# EAGLE design FINALMOTHERBOARD!!!!!!_morefinal (EAGLE 7.6.0)

## Sheet 1 of 2
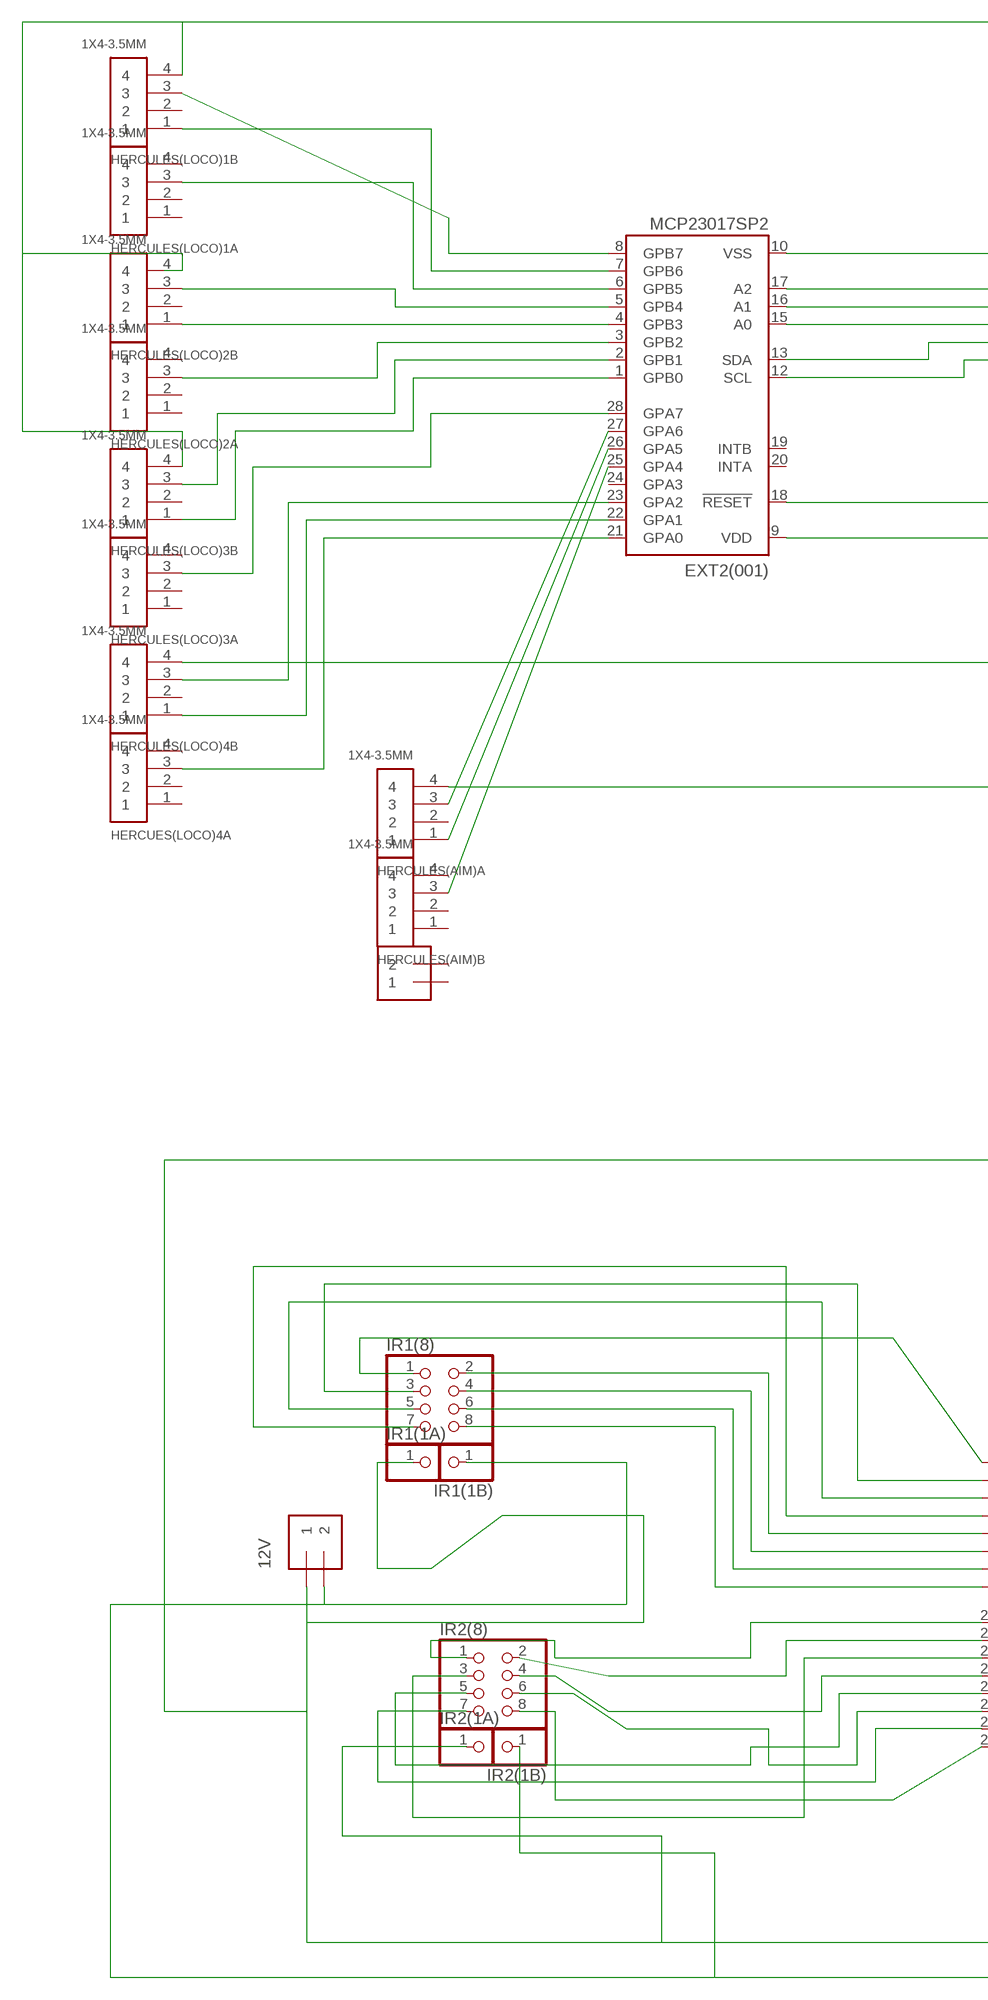
[diagram p0: schematic, sheet 1, part 1 of 2]
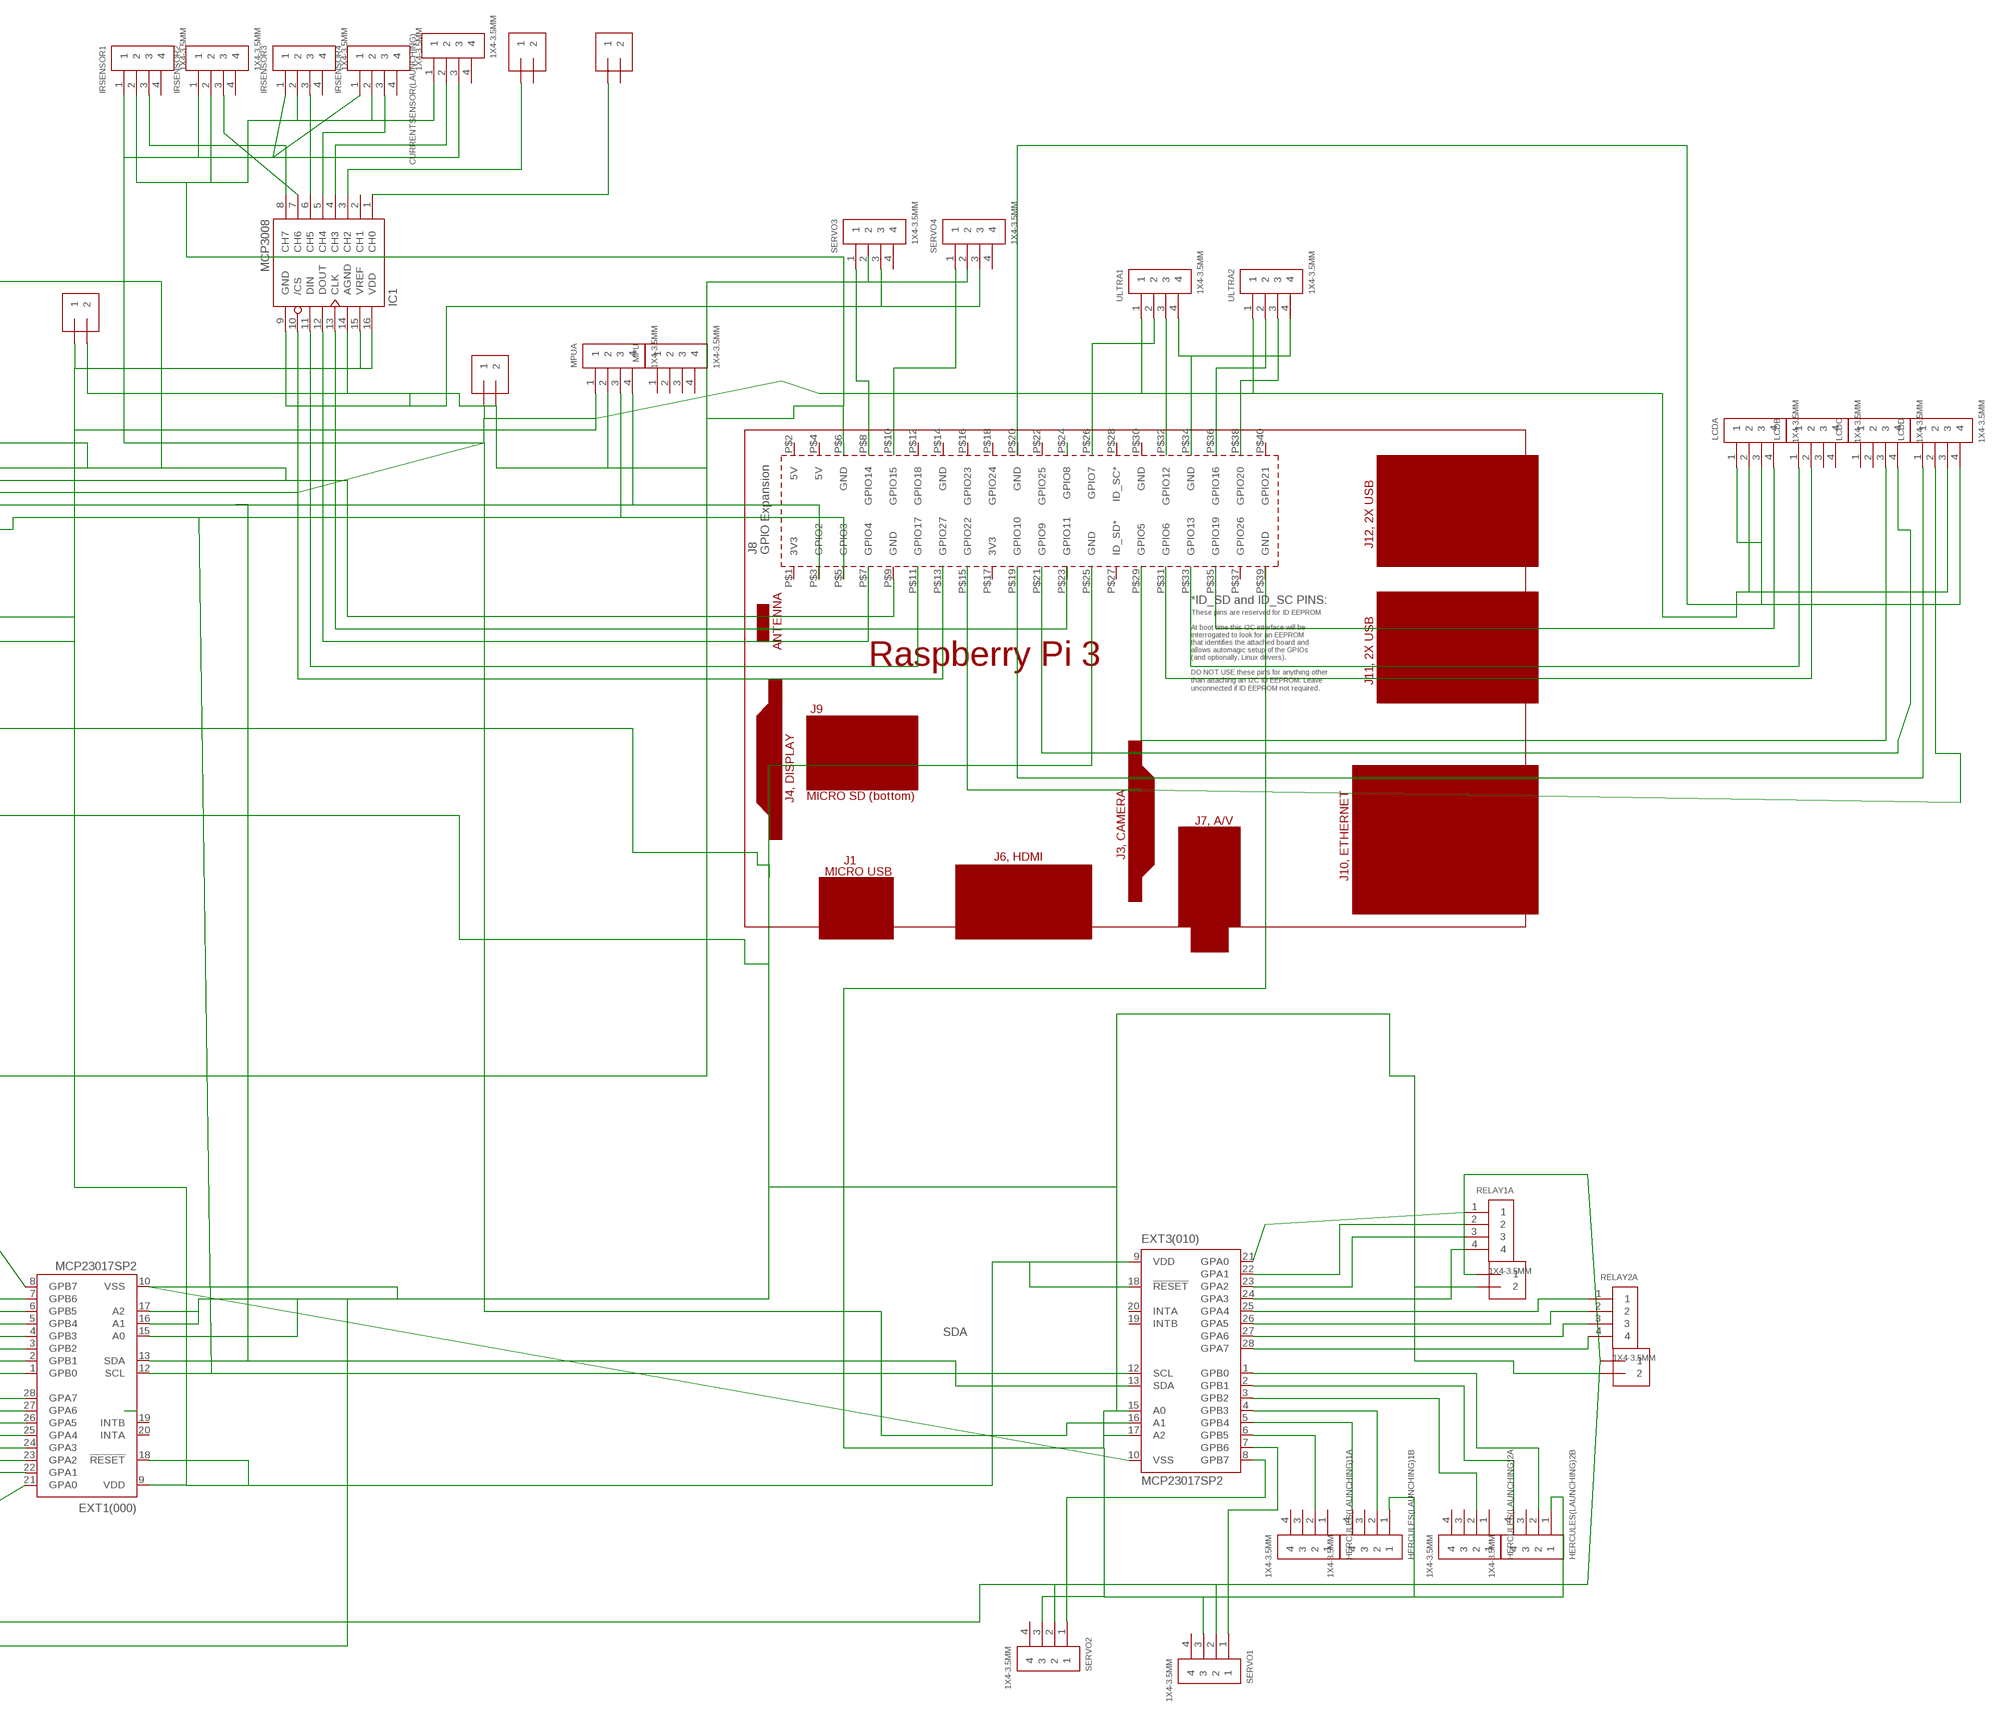
[diagram p1: schematic, sheet 1, part 2 of 2]

### Parts
3.3V  1X2-3.5MM  [1X2-3.5MM]
5V  1X2-3.5MM  [1X2-3.5MM]
12V  1X2-3.5MM  [1X2-3.5MM]
CURRENTSENSOR(LAUNCHING)  1X4-3.5MM  [1X04-3.5MM]
EXT1(000)  MCP23017SP2  [DIL28-3-ROUND]
EXT2(001)  MCP23017SP2  [DIL28-3-ROUND]
EXT3(010)  MCP23017SP2  [DIL28-3-ROUND]
HERCUES(LOCO)4A  1X4-3.5MM  [1X04-3.5MM]
HERCULES(AIM)A  1X4-3.5MM  [1X04-3.5MM]
HERCULES(AIM)B  1X4-3.5MM  [1X04-3.5MM]
HERCULES(AIM)C  1X2-3.5MM  [1X2-3.5MM]
HERCULES(LAUNCHING)1A  1X4-3.5MM  [1X04-3.5MM]
HERCULES(LAUNCHING)1B  1X4-3.5MM  [1X04-3.5MM]
HERCULES(LAUNCHING)2A  1X4-3.5MM  [1X04-3.5MM]
HERCULES(LAUNCHING)2B  1X4-3.5MM  [1X04-3.5MM]
HERCULES(LOCO)1A  1X4-3.5MM  [1X04-3.5MM]
HERCULES(LOCO)1B  1X4-3.5MM  [1X04-3.5MM]
HERCULES(LOCO)2A  1X4-3.5MM  [1X04-3.5MM]
HERCULES(LOCO)2B  1X4-3.5MM  [1X04-3.5MM]
HERCULES(LOCO)3A  1X4-3.5MM  [1X04-3.5MM]
HERCULES(LOCO)3B  1X4-3.5MM  [1X04-3.5MM]
HERCULES(LOCO)4B  1X4-3.5MM  [1X04-3.5MM]
IC1  MCP3008  [DIL16]
IR1(1A)  PINHD-1X1  [1X01]
IR1(1B)  PINHD-1X1  [1X01]
IR1(8)  PINHD-2X4  [2X04]
IR2(1A)  PINHD-1X1  [1X01]
IR2(1B)  PINHD-1X1  [1X01]
IR2(8)  PINHD-2X4  [2X04]
IR(LOCO)1ANALOG  1X2-3.5MM  [1X2-3.5MM]
IR(LOCO)2ANALOG  1X2-3.5MM  [1X2-3.5MM]
IRSENSOR1  1X4-3.5MM  [1X04-3.5MM]
IRSENSOR2  1X4-3.5MM  [1X04-3.5MM]
IRSENSOR3  1X4-3.5MM  [1X04-3.5MM]
IRSENSOR4  1X4-3.5MM  [1X04-3.5MM]
LCDA  1X4-3.5MM  [1X04-3.5MM]
LCDB  1X4-3.5MM  [1X04-3.5MM]
LCDC  1X4-3.5MM  [1X04-3.5MM]
LCDD  1X4-3.5MM  [1X04-3.5MM]
MPU  1X4-3.5MM  [1X04-3.5MM]
MPUA  1X4-3.5MM  [1X04-3.5MM]
PCB1  RPI3  [RPI3]
RELAY1A  1X4-3.5MM  [1X04-3.5MM]
RELAY1B  1X2-3.5MM  [1X2-3.5MM]
RELAY2A  1X4-3.5MM  [1X04-3.5MM]
RELAY2B  1X2-3.5MM  [1X2-3.5MM]
SERVO1  1X4-3.5MM  [1X04-3.5MM]
SERVO2  1X4-3.5MM  [1X04-3.5MM]
SERVO3  1X4-3.5MM  [1X04-3.5MM]
SERVO4  1X4-3.5MM  [1X04-3.5MM]
ULTRA1  1X4-3.5MM  [1X04-3.5MM]
ULTRA2  1X4-3.5MM  [1X04-3.5MM]

### Nets
3.3V: 3.3V.1 EXT1(000).9(VDD) EXT1(000).18(!RESET) EXT2(001).9(VDD) EXT2(001).18(!RESET) EXT3(010).9(VDD) EXT3(010).18(!RESET) IC1.15(VREF) IC1.16(VDD) MPUA.1
5V: 5V.1 CURRENTSENSOR(LAUNCHING).3 EXT2(001).15(A0) EXT3(010).16(A1) IRSENSOR1.1 IRSENSOR2.1 IRSENSOR3.1 IRSENSOR4.1 LCDA.2 LCDD.3 ULTRA1.1 ULTRA2.1
12V: 12V.1 IR1(1A).1 IR2(1A).1 RELAY1B.1 RELAY2B.1 SERVO1.2 SERVO2.2 SERVO3.2 SERVO4.2
ANALOG(CURRENTSENSOR): CURRENTSENSOR(LAUNCHING).2 IC1.4(CH3)
ANALOG(IR1): IC1.8(CH7) IRSENSOR1.3
ANALOG(IR2): IC1.7(CH6) IRSENSOR2.3
CS(ADC): IC1.10(/CS) PCB1.P$13(GPIO27)
CS(MCP3008): PCB1.P$24(GPIO8)
DIN(MCP3008): IC1.11(DIN) PCB1.P$11(GPIO17)
DIR1(HERC1L): EXT2(001).8(GPB7) HERCULES(LOCO)1B.3
DIR1(HERCULES2)LOCO: EXT2(001).5(GPB4) HERCULES(LOCO)2B.3
DIR1(HERCULES3)LOCO: EXT2(001).2(GPB1) HERCULES(LOCO)3B.3
DIR1(HERCULES4)LOCO: EXT2(001).23(GPA2) HERCULES(LOCO)4B.3
DIR2(HERCULES1)LOCO: EXT2(001).6(GPB5) HERCULES(LOCO)1A.3
DIR2(HERCULES2)LOCO: EXT2(001).3(GPB2) HERCULES(LOCO)2A.3
DIR2(HERCULES3)LOCO: EXT2(001).28(GPA7) HERCULES(LOCO)3A.3
DIR2(HERCULES4)LOCO: EXT2(001).21(GPA0) HERCUES(LOCO)4A.3
DOUT(MCP3008): IC1.12(DOUT) PCB1.P$7(GPIO4)
ECHO(US1: PCB1.P$32(GPIO12) ULTRA1.3
ECHO(US2): PCB1.P$38(GPIO20) ULTRA2.3
ENABLE(LCD): LCDB.2 PCB1.P$31(GPIO6)
GND: 12V.2 EXT1(000).10(VSS) EXT1(000).15(A0) EXT1(000).16(A1) EXT1(000).17(A2) EXT3(010).10(VSS) EXT3(010).15(A0) EXT3(010).17(A2) HERCULES(AIM)A.4 HERCULES(LAUNCHING)1B.1 HERCULES(LAUNCHING)2B.1 HERCULES(LOCO)4B.4 IR1(1B).1 IR2(1B).1 PCB1.P$25(GND) RELAY1B.2 RELAY2B.2 SERVO1.3 SERVO2.3
GND6: EXT2(001).10(VSS) EXT2(001).16(A1) EXT2(001).17(A2) HERCULES(LOCO)1B.4 HERCULES(LOCO)2B.4 HERCULES(LOCO)3B.4 PCB1.P$9(GND)
GND8: PCB1.P$34(GND) ULTRA1.4 ULTRA2.4
GND9: 3.3V.2 5V.2 CURRENTSENSOR(LAUNCHING).1 IC1.9(GND) IC1.14(AGND) IRSENSOR1.2 IRSENSOR2.2 IRSENSOR3.2 IRSENSOR4.2 MPUA.2 PCB1.P$6(GND) SERVO3.3 SERVO4.3
GRND1: LCDA.1 LCDA.3 LCDD.4
HERCULES(AIM)DIR1: EXT2(001).27(GPA6) HERCULES(AIM)A.3
HERCULES(AIM)DIR2: EXT2(001).25(GPA4) HERCULES(AIM)B.3
HERCULES(LAUNCHING1)DIR1: EXT3(010).4(GPB3) HERCULES(LAUNCHING)1B.2
HERCULES(LAUNCHING1)DIR2: EXT3(010).6(GPB5) HERCULES(LAUNCHING)1A.2
HERCULES(LAUNCHING1)PWM: EXT3(010).5(GPB4) HERCULES(LAUNCHING)1B.4
HERCULES(LAUNCHING2)DIR1: EXT3(010).1(GPB0) HERCULES(LAUNCHING)2B.2
HERCULES(LAUNCHING2)DIR2: EXT3(010).3(GPB2) HERCULES(LAUNCHING)2A.2
HERCULES(LAUNCHING2)PWM: EXT3(010).2(GPB1) HERCULES(LAUNCHING)2B.4
HERCULES(PWM)DIR1: EXT2(001).26(GPA5) HERCULES(AIM)A.1
INPUT(SERVO3): PCB1.P$8(GPIO14) SERVO3.1
INPUT(SERVO4): PCB1.P$10(GPIO15) SERVO4.1
IR3(ANALOG): IC1.6(CH5) IRSENSOR3.3
IR4(ANALOG): IC1.5(CH4) IRSENSOR4.3
IR(JPULSE)1: IC1.3(CH2) IR(LOCO)1ANALOG.1
IR(JPULSE)2: IC1.1(CH0) IR(LOCO)2ANALOG.1
LCDD0: LCDD.2 PCB1.P$15(GPIO22)
LCDD1: LCDD.1 PCB1.P$19(GPIO10)
LCDD2: LCDC.4 PCB1.P$21(GPIO9)
LCDD3: LCDC.3 PCB1.P$29(GPIO5)
N$2: EXT1(000).6(GPB5) IR1(8).5
N$3: EXT1(000).4(GPB3) IR1(8).2
O1(IR1): EXT1(000).8(GPB7) IR1(8).1
O1(IR2): EXT1(000).28(GPA7) IR2(8).1
O2(IR1): EXT1(000).7(GPB6) IR1(8).3
O2(IR2): EXT1(000).27(GPA6) IR2(8).2
O3(IR2): EXT1(000).26(GPA5) IR2(8).3
O4(IR1): EXT1(000).5(GPB4) IR1(8).7
O4(IR2): EXT1(000).25(GPA4) IR2(8).4
O5(IR2): EXT1(000).24(GPA3) IR2(8).5
O6(IR1): EXT1(000).3(GPB2) IR1(8).4
O6(IR2): EXT1(000).23(GPA2) IR2(8).6
O7(IR1): EXT1(000).2(GPB1) IR1(8).6
O7(IR2): EXT1(000).22(GPA1) IR2(8).7
O8(IR1): EXT1(000).1(GPB0) IR1(8).8
O8(IR2): EXT1(000).21(GPA0) IR2(8).8
PWM(HERCULES1)LOCO: EXT2(001).7(GPB6) HERCULES(LOCO)1B.1
PWM(HERCULES2)LOCO: EXT2(001).4(GPB3) HERCULES(LOCO)2B.1
PWM(HERCULES3)LOCO: EXT2(001).1(GPB0) HERCULES(LOCO)3B.1
PWM(HERCULES4)LOCO: EXT2(001).22(GPA1) HERCULES(LOCO)4B.1
R/W(LCD): LCDB.1 PCB1.P$33(GPIO13)
REGISTERSELECT(LCD): LCDA.4 PCB1.P$35(GPIO19)
REL1(STEP1): EXT3(010).21(GPA0) RELAY1A.1
REL1(STEP2): EXT3(010).25(GPA4) RELAY2A.1
REL2(STEP1): EXT3(010).22(GPA1) RELAY1A.2
REL2(STEP2): EXT3(010).26(GPA5) RELAY2A.2
REL3(STEP1): EXT3(010).23(GPA2) RELAY1A.3
REL3(STEP2): EXT3(010).27(GPA6) RELAY2A.3
REL4(STEP1): EXT3(010).24(GPA3) RELAY1A.4
REL4(STEP2): EXT3(010).28(GPA7) RELAY2A.4
SCK: IC1.13(CLK) PCB1.P$23(GPIO11)
SCL: EXT1(000).12(SCL) EXT2(001).12(SCL) EXT3(010).12(SCL) MPUA.3 PCB1.P$5(GPIO3)
SDA: EXT1(000).13(SDA) EXT2(001).13(SDA) EXT3(010).13(SDA) MPUA.4 PCB1.P$3(GPIO2)
SERV01(INPUT): EXT3(010).7(GPB6) SERVO1.1
SERVO2(INPUT): EXT3(010).8(GPB7) SERVO2.1
TRIG(US1): PCB1.P$26(GPIO7) ULTRA1.2
TRIG(US2): PCB1.P$36(GPIO16) ULTRA2.2
Unconnected: CURRENTSENSOR(LAUNCHING).4 EXT1(000).19(INTB) EXT1(000).20(INTA) EXT2(001).19(INTB) EXT2(001).20(INTA) EXT2(001).24(GPA3) EXT3(010).19(INTB) EXT3(010).20(INTA) HERCUES(LOCO)4A.1 HERCUES(LOCO)4A.2 HERCUES(LOCO)4A.4 HERCULES(AIM)A.2 HERCULES(AIM)B.1 HERCULES(AIM)B.2 HERCULES(AIM)B.4 HERCULES(AIM)C.1 HERCULES(AIM)C.2 HERCULES(LAUNCHING)1A.1 HERCULES(LAUNCHING)1A.3 HERCULES(LAUNCHING)1A.4 HERCULES(LAUNCHING)1B.3 HERCULES(LAUNCHING)2A.1 HERCULES(LAUNCHING)2A.3 HERCULES(LAUNCHING)2A.4 HERCULES(LAUNCHING)2B.3 HERCULES(LOCO)1A.1 HERCULES(LOCO)1A.2 HERCULES(LOCO)1A.4 HERCULES(LOCO)1B.2 HERCULES(LOCO)2A.1 HERCULES(LOCO)2A.2 HERCULES(LOCO)2A.4 HERCULES(LOCO)2B.2 HERCULES(LOCO)3A.1 HERCULES(LOCO)3A.2 HERCULES(LOCO)3A.4 HERCULES(LOCO)3B.2 HERCULES(LOCO)4B.2 IC1.2(CH1) IR(LOCO)1ANALOG.2 IR(LOCO)2ANALOG.2 IRSENSOR1.4 IRSENSOR2.4 IRSENSOR3.4 IRSENSOR4.4 LCDB.3 LCDB.4 LCDC.1 LCDC.2 MPU.1 MPU.2 MPU.3 MPU.4 PCB1.P$1(3V3) PCB1.P$2(5V) PCB1.P$4(5V) PCB1.P$12(GPIO18) PCB1.P$14(GND) PCB1.P$16(GPIO23) PCB1.P$17(3V3) PCB1.P$18(GPIO24) PCB1.P$20(GND) PCB1.P$22(GPIO25) PCB1.P$27(ID_SD*) PCB1.P$28(ID_SC*) PCB1.P$30(GND) PCB1.P$37(GPIO26) PCB1.P$39(GND) PCB1.P$40(GPIO21) SERVO1.4 SERVO2.4 SERVO3.4 SERVO4.4

## Sheet 2 of 2

## Library data of the parts
3.3V 5V 12V HERCULES(AIM)C IR(LOCO)1ANALOG IR(LOCO)2ANALOG RELAY1B RELAY2B = adafruit:1X2: 3.5mm Terminal block http://www.ladyada.net/library/pcb/eaglelibrary.html
CURRENTSENSOR(LAUNCHING) HERCUES(LOCO)4A HERCULES(AIM)A HERCULES(AIM)B HERCULES(LAUNCHING)1A HERCULES(LAUNCHING)1B HERCULES(LAUNCHING)2A HERCULES(LAUNCHING)2B HERCULES(LOCO)1A HERCULES(LOCO)1B HERCULES(LOCO)2A HERCULES(LOCO)2B HERCULES(LOCO)3A HERCULES(LOCO)3B HERCULES(LOCO)4B IRSENSOR1-IRSENSOR4 LCDA LCDB LCDC LCDD MPU MPUA RELAY1A RELAY2A SERVO1-SERVO4 ULTRA1 ULTRA2 = adafruit:1X4: 4-pin connector
EXT1(000) EXT2(001) EXT3(010) = adafruit:MCP23017: http://ww1.microchip.com/downloads/en/DeviceDoc/21952a.pdf Source: http://ww1.microchip.com/downloads/en/DeviceDoc/21952a.pdf
IC1 = adafruit:MCP3008
IR1(1A) IR1(1B) IR2(1A) IR2(1B) = adafruit:PINHD-1X1: Pin header 1x1 for 0.1" spacing With round pins
IR1(8) IR2(8) = adafruit:PINHD-2X4: PIN HEADER
PCB1 = e14_Rpi3_RevA:RPI3: Device for Raspberry Pi 3 board created by Dave Young for www.element14.com More information and support community is available at https://www.element14.com/community/community/raspberry-pi

## Board
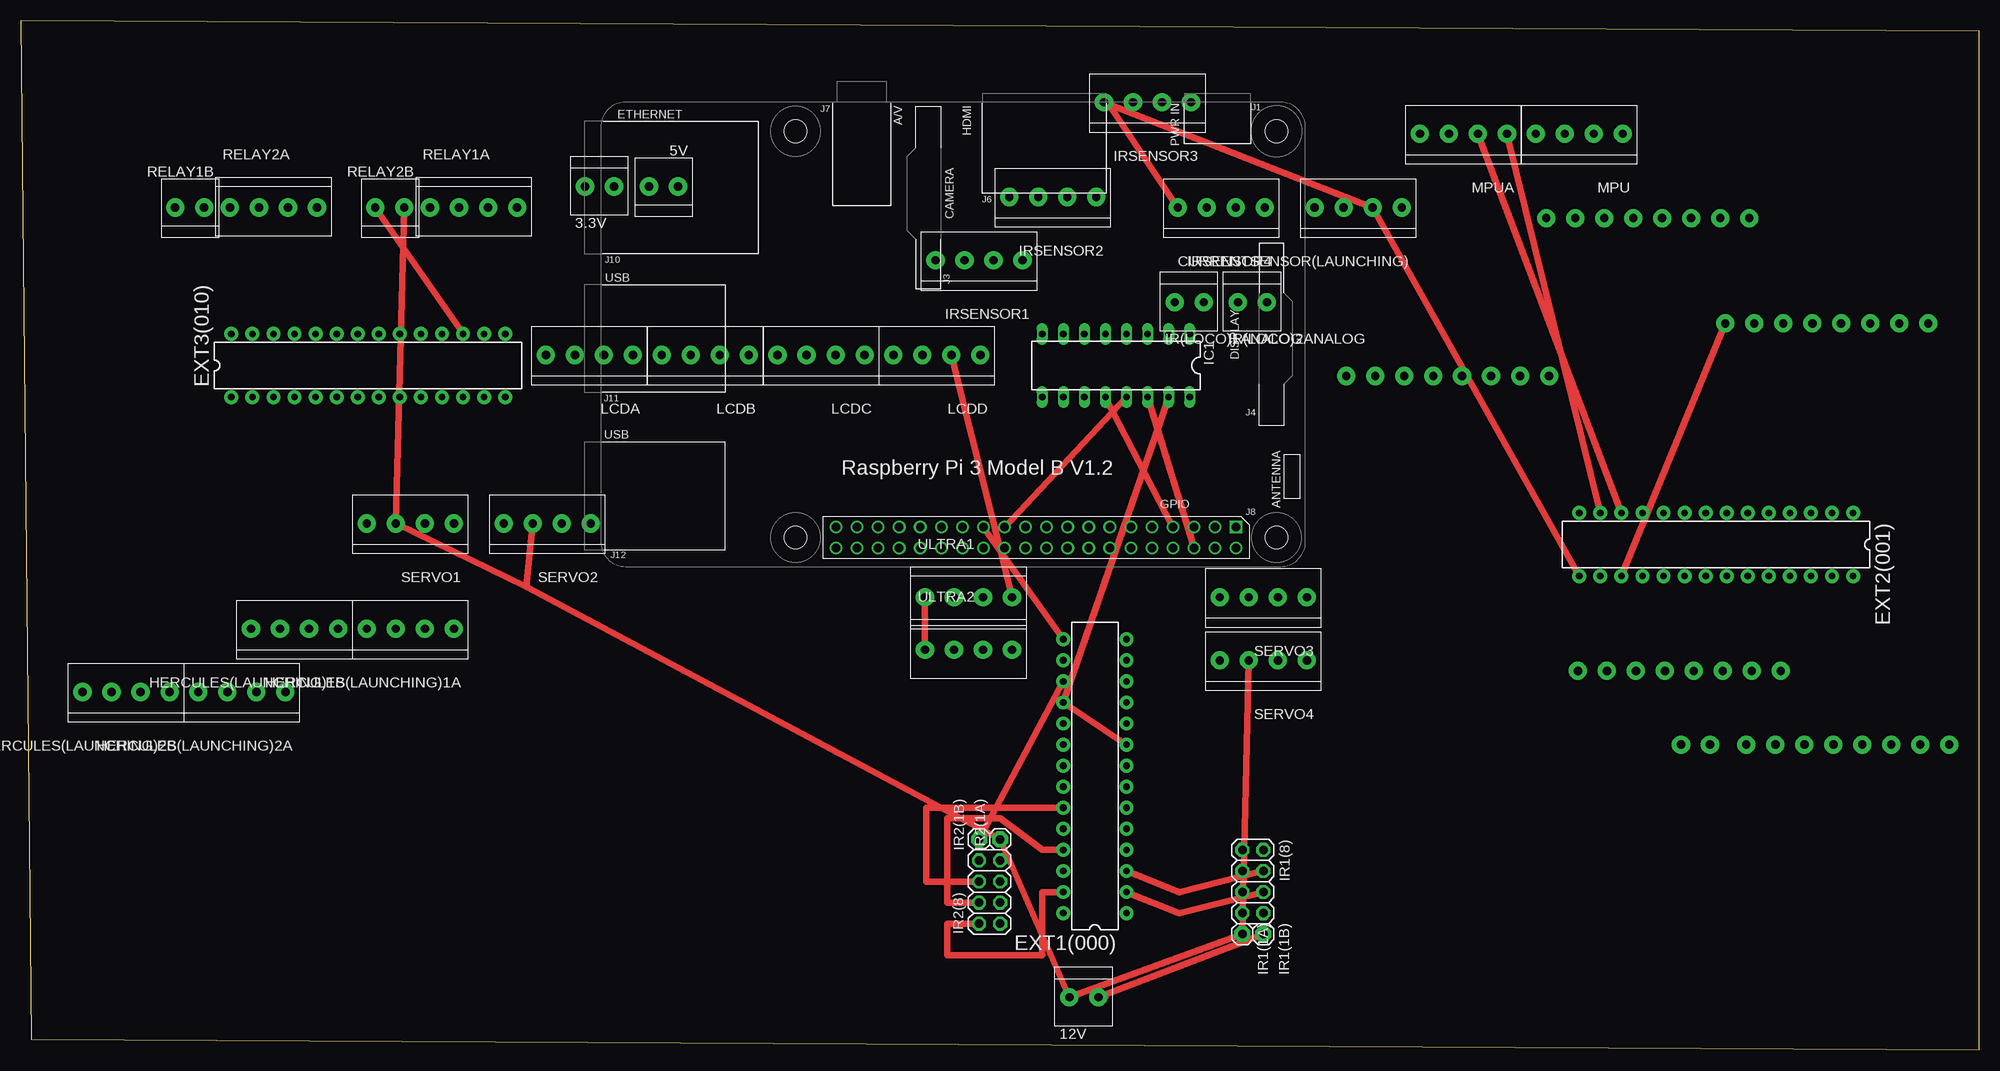
[diagram p2: board, top side]
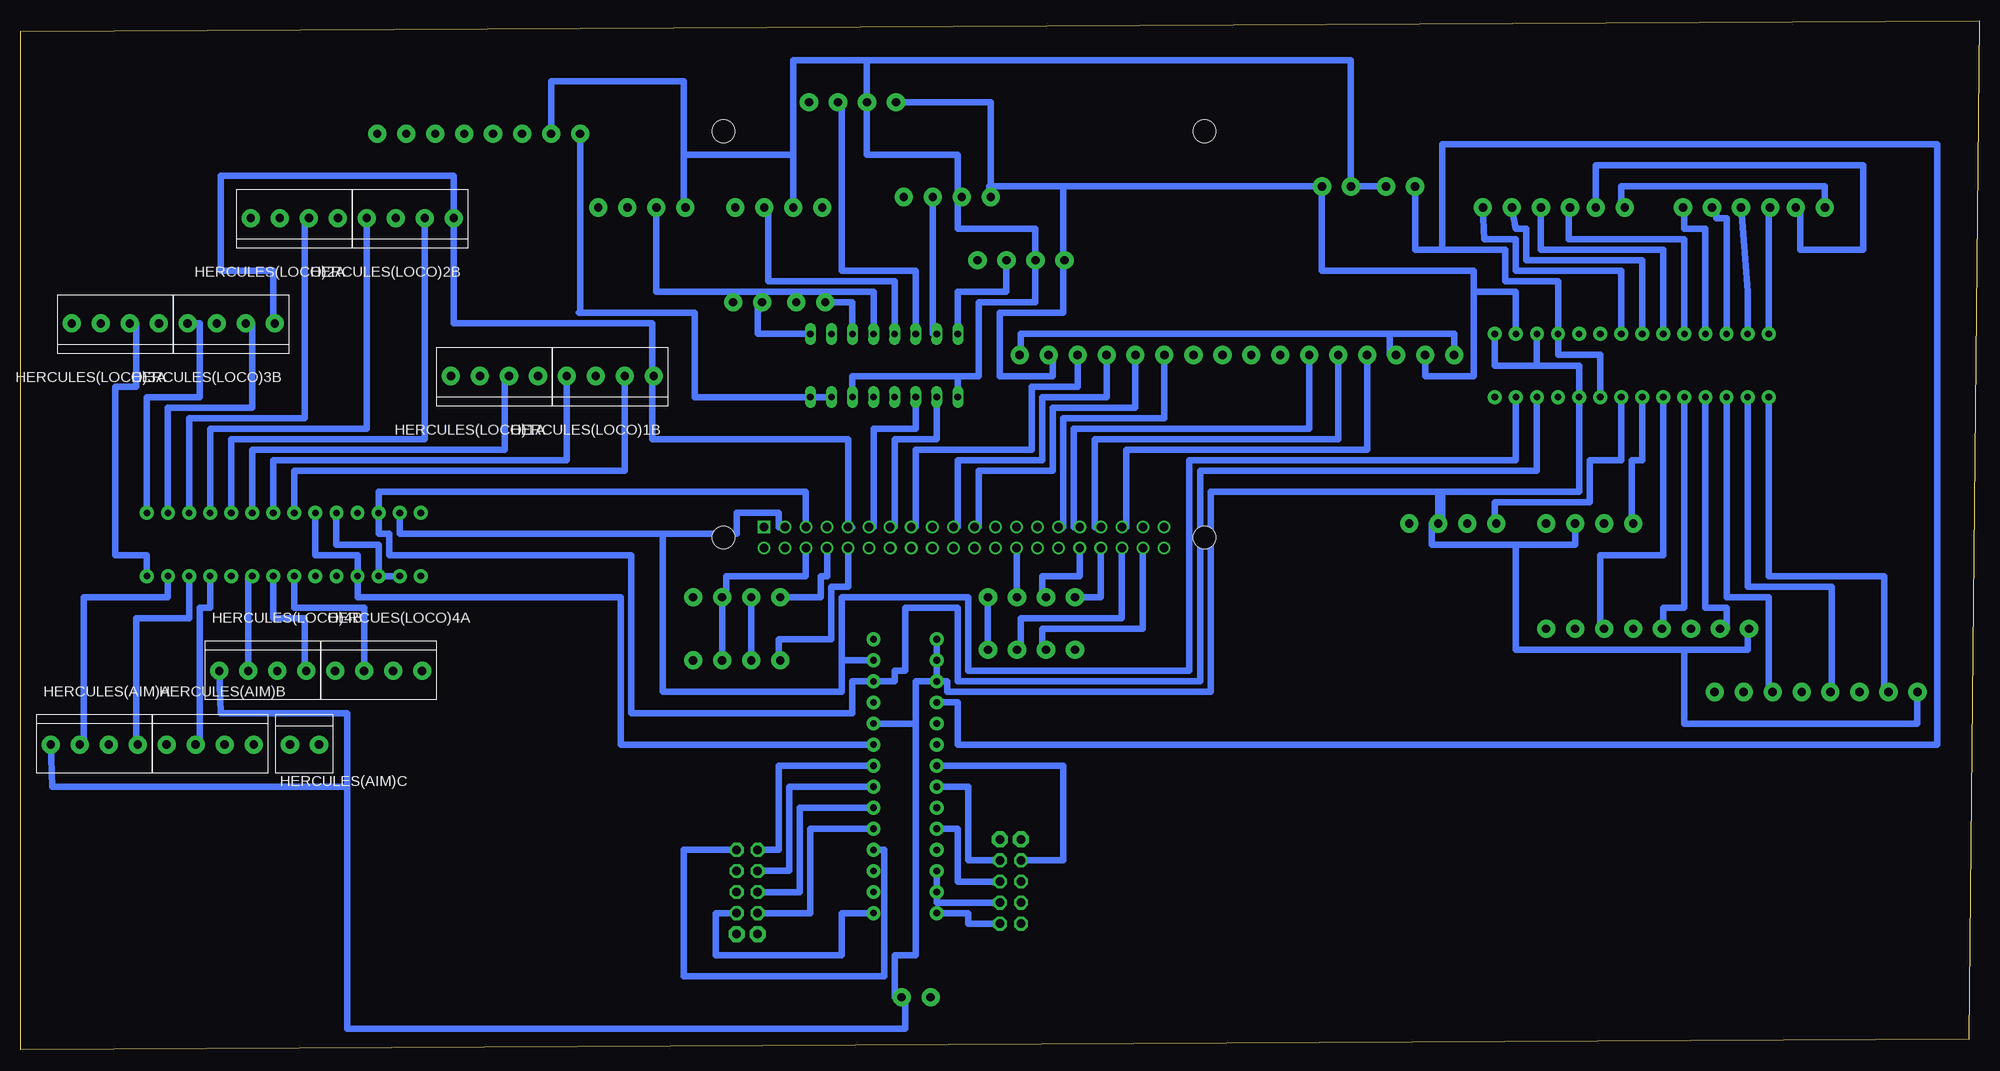
[diagram p3: board, bottom side, seen from below]

Size 236.2 x 124.13 mm. Coordinates in mm from the lower left corner, seen from the top.
Outline: 1.27,1.27 236.2,0 236.2,122.86 0,124.13 1.27,1.27
Copper layers (1*16): Top 0.035mm / dielectric 1.5mm / Bottom 0.035mm
Design rules "default": minimum track width 10mil, minimum drill 24mil, track to track 8mil, track to pad 8mil, pad to pad 8mil, via to via 8mil, smd to smd 8mil, copper to edge 40mil, drill to drill 8mil, minimum pad ring 10mil, minimum via ring 8mil, stop-mask expansion 4mil, vias tented up to drill 0mil, thermal gap 10mil

### Footprints (pad centres in the part's own frame; a part is rotated, then mirrored left to right if it is on the bottom)
1X2-3.5MM = drill 1 pad 2.184: 1 1.8,0; 2 -1.7,0
1X04-3.5MM = drill 1 pad 2.184: 1 -5.25,0; 2 -1.75,0; 3 1.75,0; 4 5.25,0
DIL28-3-ROUND = drill 0.813 pad 1.676: 1 -16.51,-3.81; 2 -13.97,-3.81; 3 -11.43,-3.81; 4 -8.89,-3.81; 5 -6.35,-3.81; 6 -3.81,-3.81; 7 -1.27,-3.81; 8 1.27,-3.81; 9 3.81,-3.81; 10 6.35,-3.81; 11 8.89,-3.81; 12 11.43,-3.81; 13 13.97,-3.81; 14 16.51,-3.81; 15 16.51,3.81; 16 13.97,3.81; 17 11.43,3.81; 18 8.89,3.81; 19 6.35,3.81; 20 3.81,3.81; 21 1.27,3.81; 22 -1.27,3.81; 23 -3.81,3.81; 24 -6.35,3.81; 25 -8.89,3.81; 26 -11.43,3.81; 27 -13.97,3.81; 28 -16.51,3.81
DIL16 = drill 0.813 long: 1 -8.89,-3.81; 2 -6.35,-3.81; 3 -3.81,-3.81; 4 -1.27,-3.81; 5 1.27,-3.81; 6 3.81,-3.81; 7 6.35,-3.81; 8 8.89,-3.81; 9 8.89,3.81; 10 6.35,3.81; 11 3.81,3.81; 12 1.27,3.81; 13 -1.27,3.81; 14 -3.81,3.81; 15 -6.35,3.81; 16 -8.89,3.81
1X01 = drill 1.016 pad 1.93 octagon: 1 0,0
2X04 = drill 1.016 pad 1.676 octagon: 1 -3.81,-1.27; 2 -3.81,1.27; 3 -1.27,-1.27; 4 -1.27,1.27; 5 1.27,-1.27; 6 1.27,1.27; 7 3.81,-1.27; 8 3.81,1.27
RPI3 = drill 1.016 square: P$1 8.37,51.23 | drill 1.016: P$2 8.357,53.772; P$3 10.897,51.232; P$4 10.897,53.772; P$5 13.437,51.232; P$6 13.437,53.772; P$7 15.977,51.232; P$8 15.977,53.772; P$9 18.517,51.232; P$10 18.517,53.772; P$11 21.057,51.232; P$12 21.057,53.772; P$13 23.597,51.232; P$14 23.597,53.772; P$15 26.137,51.232; P$16 26.137,53.772; P$17 28.677,51.232; P$18 28.677,53.772; P$19 31.217,51.232; P$20 31.217,53.772; P$21 33.757,51.232; P$22 33.757,53.772; P$23 36.297,51.232; P$24 36.297,53.772; P$25 38.837,51.232; P$26 38.837,53.772; P$27 41.377,51.232; P$28 41.377,53.772; P$29 43.917,51.232; P$30 43.917,53.772; P$31 46.457,51.232; P$32 46.457,53.772; P$33 48.997,51.232; P$34 48.997,53.772; P$35 51.537,51.232; P$36 51.537,53.772; P$37 54.077,51.232; P$38 54.077,53.772; P$39 56.617,51.232; P$40 56.617,53.772 | hole 2.75: 3.5,3.5; 61.5,3.5; 3.5,52.5; 61.5,52.5

### Placement (x,y rotation side)
3.3V  69.85,104.14 180 top
5V  77.47,104.14 0 top
12V  128.27,6.35 180 top
CURRENTSENSOR(LAUNCHING)  161.29,101.6 0 top
EXT1(000)  129.54,33.02 90 top
EXT2(001)  204.47,60.96 180 top
EXT3(010)  41.91,82.55 0 top
HERCUES(LOCO)4A  193.04,45.72 180 bottom
HERCULES(AIM)A  227.33,36.83 180 bottom
HERCULES(AIM)B  213.36,36.83 180 bottom
HERCULES(AIM)C  201.93,36.83 180 bottom
HERCULES(LAUNCHING)1A  46.99,50.8 0 top
HERCULES(LAUNCHING)1B  33.02,50.8 0 top
HERCULES(LAUNCHING)2A  26.67,43.18 0 top
HERCULES(LAUNCHING)2B  12.7,43.18 0 top
HERCULES(LOCO)1A  179.07,81.28 0 bottom
HERCULES(LOCO)1B  165.1,81.28 0 bottom
HERCULES(LOCO)2A  203.2,100.33 0 bottom
HERCULES(LOCO)2B  189.23,100.33 0 bottom
HERCULES(LOCO)3A  224.79,87.63 0 bottom
HERCULES(LOCO)3B  210.82,87.63 0 bottom
HERCULES(LOCO)4B  207.01,45.72 180 bottom
IC1  132.08,82.55 180 top
IR1(1A)  147.32,13.97 270 top
IR1(1B)  149.86,13.97 270 top
IR1(8)  148.59,20.32 270 top
IR2(1A)  118.11,25.4 90 top
IR2(1B)  115.57,25.4 90 top
IR2(8)  116.84,19.05 90 top
IR(LOCO)1ANALOG  140.97,90.17 180 top
IR(LOCO)2ANALOG  148.59,90.17 180 top
IRSENSOR1  115.57,95.25 0 top
IRSENSOR2  124.46,102.87 0 top
IRSENSOR3  135.89,114.3 0 top
IRSENSOR4  144.78,101.6 0 top
LCDA  68.58,83.82 0 top
LCDB  82.55,83.82 0 top
LCDC  96.52,83.82 0 top
LCDD  110.49,83.82 0 top
MPU  187.96,110.49 0 top
MPUA  173.99,110.49 0 top
PCB1  154.94,114.3 180 top
RELAY1A  54.61,101.6 180 top
RELAY1B  20.32,101.6 0 top
RELAY2A  30.48,101.6 180 top
RELAY2B  44.45,101.6 0 top
SERVO1  46.99,63.5 0 top
SERVO2  63.5,63.5 0 top
SERVO3  149.86,54.61 0 top
SERVO4  149.86,46.99 0 top
ULTRA1  114.3,54.61 180 top
ULTRA2  114.3,48.26 180 top

### Tracks (layer width: path | path; a pad name or v marks a point on that pad's centre or on a via)
3.3V
  Top 0.813: IC1.15 EXT1(000).18 EXT1(000).9
  Bottom 0.813: EXT2(001).9 200.66,59.69 195.58,59.69 EXT2(001).18 195.58,54.61 163.83,54.61 163.83,36.83 EXT1(000).9 | IC1.15 IC1.16 154.94,78.74 154.94,88.9 168.74,88.9 | MPUA.1 168.74,88.9 | 168.74,88.9 168.91,88.9 | 3.3V.1 68.05,96.52 64.77,96.52 | 64.77,96.52 57.15,96.52 57.15,92.71 50.8,92.71 EXT3(010).18 50.8,83.82 45.72,83.82 EXT3(010).9 | 64.77,96.52 64.77,109.22 5.08,109.22 5.08,36.83 123.19,36.83 123.19,41.91 EXT1(000).18
5V
  Top 0.813: EXT2(001).15 CURRENTSENSOR(LAUNCHING).3 131.22,114.07 | 131.22,114.07 IRSENSOR3.1 | IRSENSOR4.1 131.22,114.07 | ULTRA1.1 LCDD.3
  Bottom 0.813: 130.81,114.3 IRSENSOR3.1 119.21,114.3 IRSENSOR2.1 119.38,104.14 110.49,104.14 | ULTRA1.1 ULTRA2.1 | 110.49,104.14 5V.1 79.27,93.98 60.96,93.98 60.96,91.44 | 110.49,104.14 110.49,95.25 | 110.49,95.25 IRSENSOR1.1 | 60.96,91.44 55.88,91.44 EXT3(010).16 | LCDA.2 66.83,81.28 60.96,81.28 60.96,91.44 | 110.49,95.25 110.49,88.9 118.11,88.9 118.11,81.28 111.76,81.28 111.76,83.82 LCDD.3
12V
  Top 0.813: 60.96,55.88 SERVO1.2 RELAY2B.1 | 60.96,55.88 SERVO2.2 | 60.96,55.88 IR2(1A).1 12V.1 IR1(1A).1 SERVO4.2
  Bottom 0.813: SERVO4.2 SERVO3.2 | RELAY2B.1 46.25,106.68 13.97,106.68 13.97,96.52 21.59,96.52 21.59,101.6 RELAY1B.1
ANALOG(CURRENTSENSOR)
  Bottom 0.813: IC1.4 133.35,91.44 159.54,91.44 CURRENTSENSOR(LAUNCHING).2
ANALOG(IR1)
  Bottom 0.813: IC1.8 123.19,91.44 117.32,91.44 IRSENSOR1.3
ANALOG(IR2)
  Bottom 0.813: IRSENSOR2.3 126.21,86.36 IC1.7
CS(ADC)
  Bottom 0.813: IC1.10 125.73,73.66 130.81,73.66 130.81,63.07 PCB1.P$13
DIN(MCP3008)
  Bottom 0.813: IC1.11 128.27,74.93 133.35,74.93 133.35,63.07 PCB1.P$11
DIR1(HERC1L)
  Bottom 0.813: HERCULES(LOCO)1B.3 163.35,69.85 203.2,69.85 EXT2(001).8
DIR1(HERCULES2)LOCO
  Bottom 0.813: EXT2(001).5 210.82,73.66 187.48,73.66 HERCULES(LOCO)2B.3
DIR1(HERCULES3)LOCO
  Bottom 0.813: 209.55,87.63 HERCULES(LOCO)3B.3 208.28,87.63 208.28,77.47 218.44,77.47 EXT2(001).2
DIR1(HERCULES4)LOCO
  Bottom 0.813: EXT2(001).23 208.76,57.15 HERCULES(LOCO)4B.3
DIR2(HERCULES1)LOCO
  Bottom 0.813: EXT2(001).6 208.28,72.39 177.8,72.39 177.8,81.28 HERCULES(LOCO)1A.3
DIR2(HERCULES2)LOCO
  Bottom 0.813: HERCULES(LOCO)2A.3 201.93,100.33 201.93,76.2 215.9,76.2 EXT2(001).3
DIR2(HERCULES3)LOCO
  Bottom 0.813: 223.52,87.63 HERCULES(LOCO)3A.3 222.25,87.63 222.25,80.01 224.79,80.01 224.79,59.69 220.98,59.69 EXT2(001).28
DIR2(HERCULES4)LOCO
  Bottom 0.813: HERCUES(LOCO)4A.3 194.79,53.34 203.2,53.34 EXT2(001).21
DOUT(MCP3008)
  Top 0.813: IC1.12 PCB1.P$7
ECHO(US1
  Bottom 0.813: PCB1.P$32 108.48,57.15 113.03,57.15 113.03,54.61 ULTRA1.3
ECHO(US2)
  Bottom 0.813: PCB1.P$38 100.86,50.8 113.03,50.8 113.03,48.26 ULTRA2.3
ENABLE(LCD)
  Bottom 0.813: LCDB.2 80.8,74.93 109.22,74.93 109.22,63.07 PCB1.P$31
GND
  Top 0.813: PCB1.P$25 EXT1(000).15 | IR2(1B).1 EXT1(000).17 | 130.81,6.35 12V.2 IR1(1B).1 | EXT3(010).17 RELAY2B.2
  Bottom 0.813: EXT1(000).17 EXT1(000).16 EXT1(000).15 | 196.85,31.75 196.85,40.64 212.09,40.64 HERCULES(LOCO)4B.4 | HERCULES(AIM)A.4 232.41,31.75 196.85,31.75 | HERCULES(LAUNCHING)2B.1 7.45,39.37 35.56,39.37 35.56,48.26 | 35.56,48.26 27.94,48.26 27.94,50.8 HERCULES(LAUNCHING)1B.1 | SERVO1.3 48.74,60.96 55.88,60.96 | 55.88,60.96 66.04,60.96 66.04,63.5 SERVO2.3 | 55.88,60.96 55.88,48.26 35.56,48.26 | EXT3(010).17 53.34,82.55 | 53.34,82.55 58.42,82.55 EXT3(010).15 | 53.34,82.55 48.26,82.55 EXT3(010).10 48.26,67.31 64.77,67.31 | 64.77,67.31 64.77,63.5 SERVO2.3 | SERVO2.3 65.25,67.31 | 65.25,67.31 64.77,67.31 | 65.25,67.31 92.71,67.31 92.71,43.18 124.46,43.18 124.46,44.45 EXT1(000).17 | EXT1(000).17 128.27,44.45 128.27,39.37 | EXT1(000).10 128.27,39.37 | 128.27,39.37 128.27,11.43 130.81,11.43 130.81,6.35 12V.2 129.54,6.35 129.54,2.54 196.85,2.54 196.85,31.75 | RELAY1B.2 18.62,104.14 43.18,104.14 43.18,101.6 RELAY2B.2
GND6
  Top 0.813: HERCULES(LOCO)3B.4 EXT2(001).17
  Bottom 0.813: EXT2(001).16 EXT2(001).17 193.04,60.96 198.12,60.96 EXT2(001).10 | 135.89,63.07 PCB1.P$9 136.42,73.66 160.02,73.66 160.02,81.28 | HERCULES(LOCO)3B.4 205.74,87.63 205.74,93.98 212.09,93.98 212.09,105.41 183.98,105.41 HERCULES(LOCO)2B.4 183.98,87.63 160.02,87.63 160.02,81.28 | 160.02,81.28 HERCULES(LOCO)1B.4
GND8
  Top 0.813: ULTRA2.4 ULTRA1.4
  Bottom 0.813: PCB1.P$34 105.94,54.61 ULTRA1.4
GND9
  Top 0.813: IC1.14 PCB1.P$6
  Bottom 0.813: 123.19,81.28 120.65,81.28 120.65,90.17 113.82,90.17 IRSENSOR1.2 113.82,99.06 123.19,99.06 123.19,102.87 | IC1.9 123.19,81.28 | 123.19,81.28 135.89,81.28 IC1.14 | 123.19,102.87 123.19,107.95 134.14,107.95 IRSENSOR3.2 134.14,119.38 | 123.19,102.87 IRSENSOR2.2 | 134.14,119.38 143.03,119.38 IRSENSOR4.2 143.03,107.95 156.21,107.95 | PCB1.P$6 141.5,57.15 151.13,57.15 151.13,54.61 SERVO3.3 SERVO4.3 | 134.14,119.38 75.77,119.38 5V.2 3.3V.2 | 156.21,107.95 156.21,101.6 CURRENTSENSOR(LAUNCHING).1 | 156.21,107.95 156.21,116.84 172.24,116.84 MPUA.2
GRND1
  Bottom 0.813: LCDA.1 63.33,86.36 71.12,86.36 | LCDA.3 71.12,83.82 71.12,86.36 | 71.12,86.36 115.57,86.36 115.57,83.82 LCDD.4
HERCULES(AIM)DIR1
  Bottom 0.813: HERCULES(AIM)A.3 228.6,36.83 228.6,54.61 218.44,54.61 EXT2(001).27
HERCULES(AIM)DIR2
  Bottom 0.813: HERCULES(AIM)B.3 214.63,36.83 214.63,53.34 213.36,53.34 EXT2(001).25
HERCULES(LAUNCHING1)DIR1
  Bottom 0.813: EXT3(010).4 33.02,53.34 30.48,53.34 30.48,50.8 HERCULES(LAUNCHING)1B.2
HERCULES(LAUNCHING1)DIR2
  Bottom 0.813: EXT3(010).6 38.1,59.69 45.72,59.69 45.72,50.8 HERCULES(LAUNCHING)1A.2
HERCULES(LAUNCHING1)PWM
  Bottom 0.813: EXT3(010).5 35.56,53.34 38.1,53.34 38.1,50.8 HERCULES(LAUNCHING)1B.4
HERCULES(LAUNCHING2)DIR1
  Bottom 0.813: EXT3(010).1 25.4,57.15 11.43,57.15 11.43,43.18 HERCULES(LAUNCHING)2B.2
HERCULES(LAUNCHING2)DIR2
  Bottom 0.813: EXT3(010).3 30.48,54.61 25.4,54.61 25.4,43.18 HERCULES(LAUNCHING)2A.2
HERCULES(LAUNCHING2)PWM
  Bottom 0.813: EXT3(010).2 27.94,55.88 17.78,55.88 17.78,43.18 HERCULES(LAUNCHING)2B.4
HERCULES(PWM)DIR1
  Bottom 0.813: EXT2(001).26 215.9,52.07 222.25,52.07 222.25,36.83 HERCULES(AIM)A.1
INPUT(SERVO3)
  Bottom 0.813: SERVO3.1 139.7,54.61 139.7,57.15 138.96,57.15 PCB1.P$8
INPUT(SERVO4)
  Bottom 0.813: PCB1.P$10 136.42,55.88 138.43,55.88 138.43,49.53 144.78,49.53 144.78,46.99 SERVO4.1
IR3(ANALOG)
  Bottom 0.813: IC1.6 128.27,93.98 137.16,93.98 137.16,114.3 IRSENSOR3.3
IR4(ANALOG)
  Bottom 0.813: IRSENSOR4.3 146.05,101.6 146.05,92.71 130.81,92.71 IC1.5
IR(JPULSE)1
  Bottom 0.813: IR(LOCO)1ANALOG.1 135.89,90.17 IC1.3
IR(JPULSE)2
  Bottom 0.813: 147.32,88.9 IR(LOCO)2ANALOG.1 147.32,90.17 147.32,86.36 IC1.1
LCDD0
  Bottom 0.813: LCDD.2 108.74,80.01 114.3,80.01 114.3,72.39 128.27,72.39 128.27,63.07 PCB1.P$15
LCDD1
  Bottom 0.813: LCDD.1 105.24,78.74 113.03,78.74 113.03,71.12 123.19,71.12 123.19,63.07 PCB1.P$19
LCDD2
  Bottom 0.813: LCDC.4 101.77,77.47 111.76,77.47 111.76,69.85 120.65,69.85 120.65,63.07 PCB1.P$21
LCDD3
  Bottom 0.813: LCDC.3 98.27,76.2 110.49,76.2 110.49,63.07 PCB1.P$29
N$2
  Bottom 0.813: EXT1(000).6 142.24,29.21 142.24,19.05 IR1(8).5
N$3
  Bottom 0.813: IR1(8).2 156.21,24.13 156.21,8.89 132.08,8.89 132.08,24.13 EXT1(000).4
O1(IR1)
  Bottom 0.813: EXT1(000).8 144.78,34.29 144.78,24.13 IR1(8).1
O1(IR2)
  Bottom 0.813: IR2(8).1 121.92,15.24 121.92,16.51 EXT1(000).28
O2(IR1)
  Bottom 0.813: EXT1(000).7 143.51,31.75 143.51,21.59 IR1(8).3
O2(IR2)
  Top 0.813: EXT1(000).27 123.19,19.05 123.19,11.43 111.76,11.43 111.76,15.24 IR2(8).2
O3(IR2)
  Bottom 0.813: EXT1(000).26 125.73,17.78 IR2(8).3
O4(IR1)
  Bottom 0.813: EXT1(000).5 140.97,26.67 140.97,16.51 IR1(8).7
O4(IR2)
  Top 0.813: IR2(8).4 111.76,17.78 111.76,27.94 118.11,27.94 123.19,24.13 EXT1(000).25
O5(IR2)
  Bottom 0.813: IR2(8).5 123.19,20.32 123.19,26.67 EXT1(000).24
O6(IR1)
  Top 0.813: IR1(8).4 139.7,19.05 EXT1(000).3
O6(IR2)
  Top 0.813: IR2(8).6 109.22,20.32 109.22,29.21 EXT1(000).23
O7(IR1)
  Top 0.813: IR1(8).6 139.7,16.51 EXT1(000).2
O7(IR2)
  Bottom 0.813: IR2(8).7 121.92,22.86 121.92,31.75 EXT1(000).22
O8(IR1)
  Bottom 0.813: IR1(8).8 152.4,16.51 152.4,11.43 137.16,11.43 137.16,16.51 EXT1(000).1
O8(IR2)
  Bottom 0.813: IR2(8).8 110.49,22.86 110.49,34.29 EXT1(000).21
PWM(HERCULES1)LOCO
  Bottom 0.813: EXT2(001).7 205.74,71.12 170.35,71.12 HERCULES(LOCO)1B.1
PWM(HERCULES2)LOCO
  Bottom 0.813: EXT2(001).4 213.36,74.93 194.48,74.93 HERCULES(LOCO)2B.1
PWM(HERCULES3)LOCO
  Bottom 0.813: 215.9,87.63 HERCULES(LOCO)3B.1 214.63,87.63 214.63,78.74 220.98,78.74 EXT2(001).1
PWM(HERCULES4)LOCO
  Bottom 0.813: EXT2(001).22 205.74,52.07 201.93,52.07 201.93,45.72 HERCULES(LOCO)4B.1
R/W(LCD)
  Bottom 0.813: LCDB.1 77.3,73.66 106.68,73.66 106.68,63.07 PCB1.P$33
REGISTERSELECT(LCD)
  Bottom 0.813: LCDA.4 73.83,72.39 102.87,72.39 102.87,63.07 PCB1.P$35
REL1(STEP1)
  Bottom 0.813: EXT3(010).21 43.18,93.98 55.88,93.98 55.88,97.79 59.69,97.79 RELAY1A.1
REL1(STEP2)
  Bottom 0.813: EXT3(010).25 33.02,99.06 35.56,99.06 35.56,101.6 RELAY2A.1
REL2(STEP1)
  Bottom 0.813: EXT3(010).22 40.64,95.25 54.61,95.25 54.61,99.06 55.88,99.06 RELAY1A.2
REL2(STEP2)
  Bottom 0.813: EXT3(010).26 30.48,100.33 31.75,100.33 31.75,101.6 RELAY2A.2
REL3(STEP1)
  Bottom 0.813: RELAY1A.3 52.86,96.52 38.1,96.52 EXT3(010).23
REL3(STEP2)
  Bottom 0.813: RELAY2A.3 27.94,91.44 EXT3(010).27
REL4(STEP1)
  Bottom 0.813: EXT3(010).24 35.56,97.79 49.53,97.79 49.53,101.6 RELAY1A.4
REL4(STEP2)
  Bottom 0.813: EXT3(010).28 25.4,101.6 RELAY2A.4
SCK
  Top 0.813: IC1.13 PCB1.P$23
SCL
  Top 0.813: MPUA.3 EXT2(001).12
  Bottom 0.813: EXT3(010).12 53.34,69.85 93.98,69.85 93.98,44.45 123.19,44.45 123.19,53.34 129.54,53.34 129.54,45.72 130.81,45.72 130.81,44.45 EXT1(000).12 135.89,44.45 135.89,40.64 162.56,40.64 162.56,59.69 191.77,59.69 191.77,62.23 193.04,62.23 EXT2(001).12 193.04,67.31 141.5,67.31 PCB1.P$5
SDA
  Top 0.813: MPUA.4 EXT2(001).13
  Bottom 0.813: EXT3(010).13 55.88,71.12 95.25,71.12 95.25,45.72 121.92,45.72 121.92,54.61 137.16,54.61 137.16,46.99 | EXT2(001).13 190.5,62.23 158.75,62.23 | 158.75,62.23 149.86,62.23 149.86,64.77 144.78,64.77 144.78,63.07 PCB1.P$3 | EXT1(000).13 137.16,46.99 | 137.16,46.99 137.16,43.18 158.75,43.18 158.75,62.23
SERV01(INPUT)
  Bottom 0.813: EXT3(010).7 40.64,71.12 41.91,71.12 41.91,63.5 SERVO1.1
SERVO2(INPUT)
  Bottom 0.813: EXT3(010).8 43.18,71.12 46.99,71.12 46.99,66.04 58.42,66.04 58.42,63.5 SERVO2.1
TRIG(US1)
  Bottom 0.813: ULTRA1.2 116.05,60.53 PCB1.P$26
TRIG(US2)
  Bottom 0.813: PCB1.P$36 103.4,52.07 115.57,52.07 115.57,48.26 ULTRA2.2